# Altium schematic sheet Connectors.SchDoc: Mezzanine Connectors
size A; Organization: UCLA High Energy Physics; DocumentNumber: 2; Revision: 2.0; SheetNumber: 2; SheetTotal: 23; CurrentDate: 9/6/2018; ModifiedDate: 9/6/2018
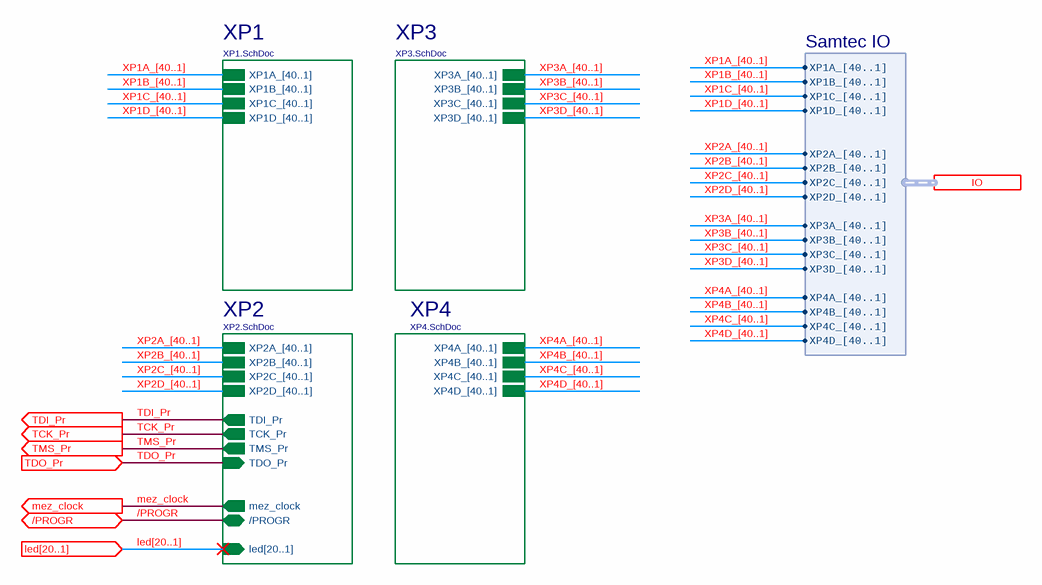
[diagram p0: Connectors.SchDoc]

## Sub-sheets
XP1 = XP1.SchDoc: XP1A_[40..1], XP1B_[40..1], XP1C_[40..1], XP1D_[40..1]
XP2 = XP2.SchDoc: XP2C_[40..1], XP2D_[40..1], TCK_Pr (out), TMS_Pr (out), TDI_Pr (out), TDO_Pr (in), mez_clock (out), /PROGR (bidir), XP2B_[40..1], XP2A_[40..1], led[20..1] (in)
XP3 = XP3.SchDoc: XP3A_[40..1], XP3B_[40..1], XP3C_[40..1], XP3D_[40..1]
XP4 = XP4.SchDoc: XP4A_[40..1], XP4B_[40..1], XP4C_[40..1], XP4D_[40..1]

## Ports
/PROGR (bidir), IO (harness Samtec IO), led[20..1] (in), mez_clock (out), TCK_Pr (out), TDI_Pr (out), TDO_Pr (in), TMS_Pr (out)

## Harnesses
Samtec IO: XP1A_[40..1], XP1B_[40..1], XP1C_[40..1], XP1D_[40..1], XP2A_[40..1], XP2B_[40..1], XP2C_[40..1], XP2D_[40..1], XP3A_[40..1], XP3B_[40..1], XP3C_[40..1], XP3D_[40..1], XP4A_[40..1], XP4B_[40..1], XP4C_[40..1], XP4D_[40..1]

## Nets
/PROGR: port /PROGR, sheet XP2//PROGR
mez_clock: port mez_clock, sheet XP2/mez_clock
TCK_Pr: port TCK_Pr, sheet XP2/TCK_Pr
TDI_Pr: port TDI_Pr, sheet XP2/TDI_Pr
TDO_Pr: port TDO_Pr, sheet XP2/TDO_Pr
TMS_Pr: port TMS_Pr, sheet XP2/TMS_Pr

## Buses and harness runs
bus led[20..1] = port led[20..1] = sheet XP2/led[20..1]
bus XP1A_[40..1]
bus XP1A_[40..1] = sheet XP1/XP1A_[40..1]
bus XP1B_[40..1]
bus XP1B_[40..1] = sheet XP1/XP1B_[40..1]
bus XP1C_[40..1]
bus XP1C_[40..1] = sheet XP1/XP1C_[40..1]
bus XP1D_[40..1]
bus XP1D_[40..1] = sheet XP1/XP1D_[40..1]
bus XP2A_[40..1]
bus XP2A_[40..1] = sheet XP2/XP2A_[40..1]
bus XP2B_[40..1]
bus XP2B_[40..1] = sheet XP2/XP2B_[40..1]
bus XP2C_[40..1]
bus XP2C_[40..1] = sheet XP2/XP2C_[40..1]
bus XP2D_[40..1]
bus XP2D_[40..1] = sheet XP2/XP2D_[40..1]
bus XP3A_[40..1]
bus XP3A_[40..1] = sheet XP3/XP3A_[40..1]
bus XP3B_[40..1]
bus XP3B_[40..1] = sheet XP3/XP3B_[40..1]
bus XP3C_[40..1]
bus XP3C_[40..1] = sheet XP3/XP3C_[40..1]
bus XP3D_[40..1]
bus XP3D_[40..1] = sheet XP3/XP3D_[40..1]
bus XP4A_[40..1]
bus XP4A_[40..1] = sheet XP4/XP4A_[40..1]
bus XP4B_[40..1]
bus XP4B_[40..1] = sheet XP4/XP4B_[40..1]
bus XP4C_[40..1]
bus XP4C_[40..1] = sheet XP4/XP4C_[40..1]
bus XP4D_[40..1]
bus XP4D_[40..1] = sheet XP4/XP4D_[40..1]

## Notes on the sheet
- Date:
- Rev:
- of
- Sheet